# Altium schematic sheet Controller.SchDoc
size A2
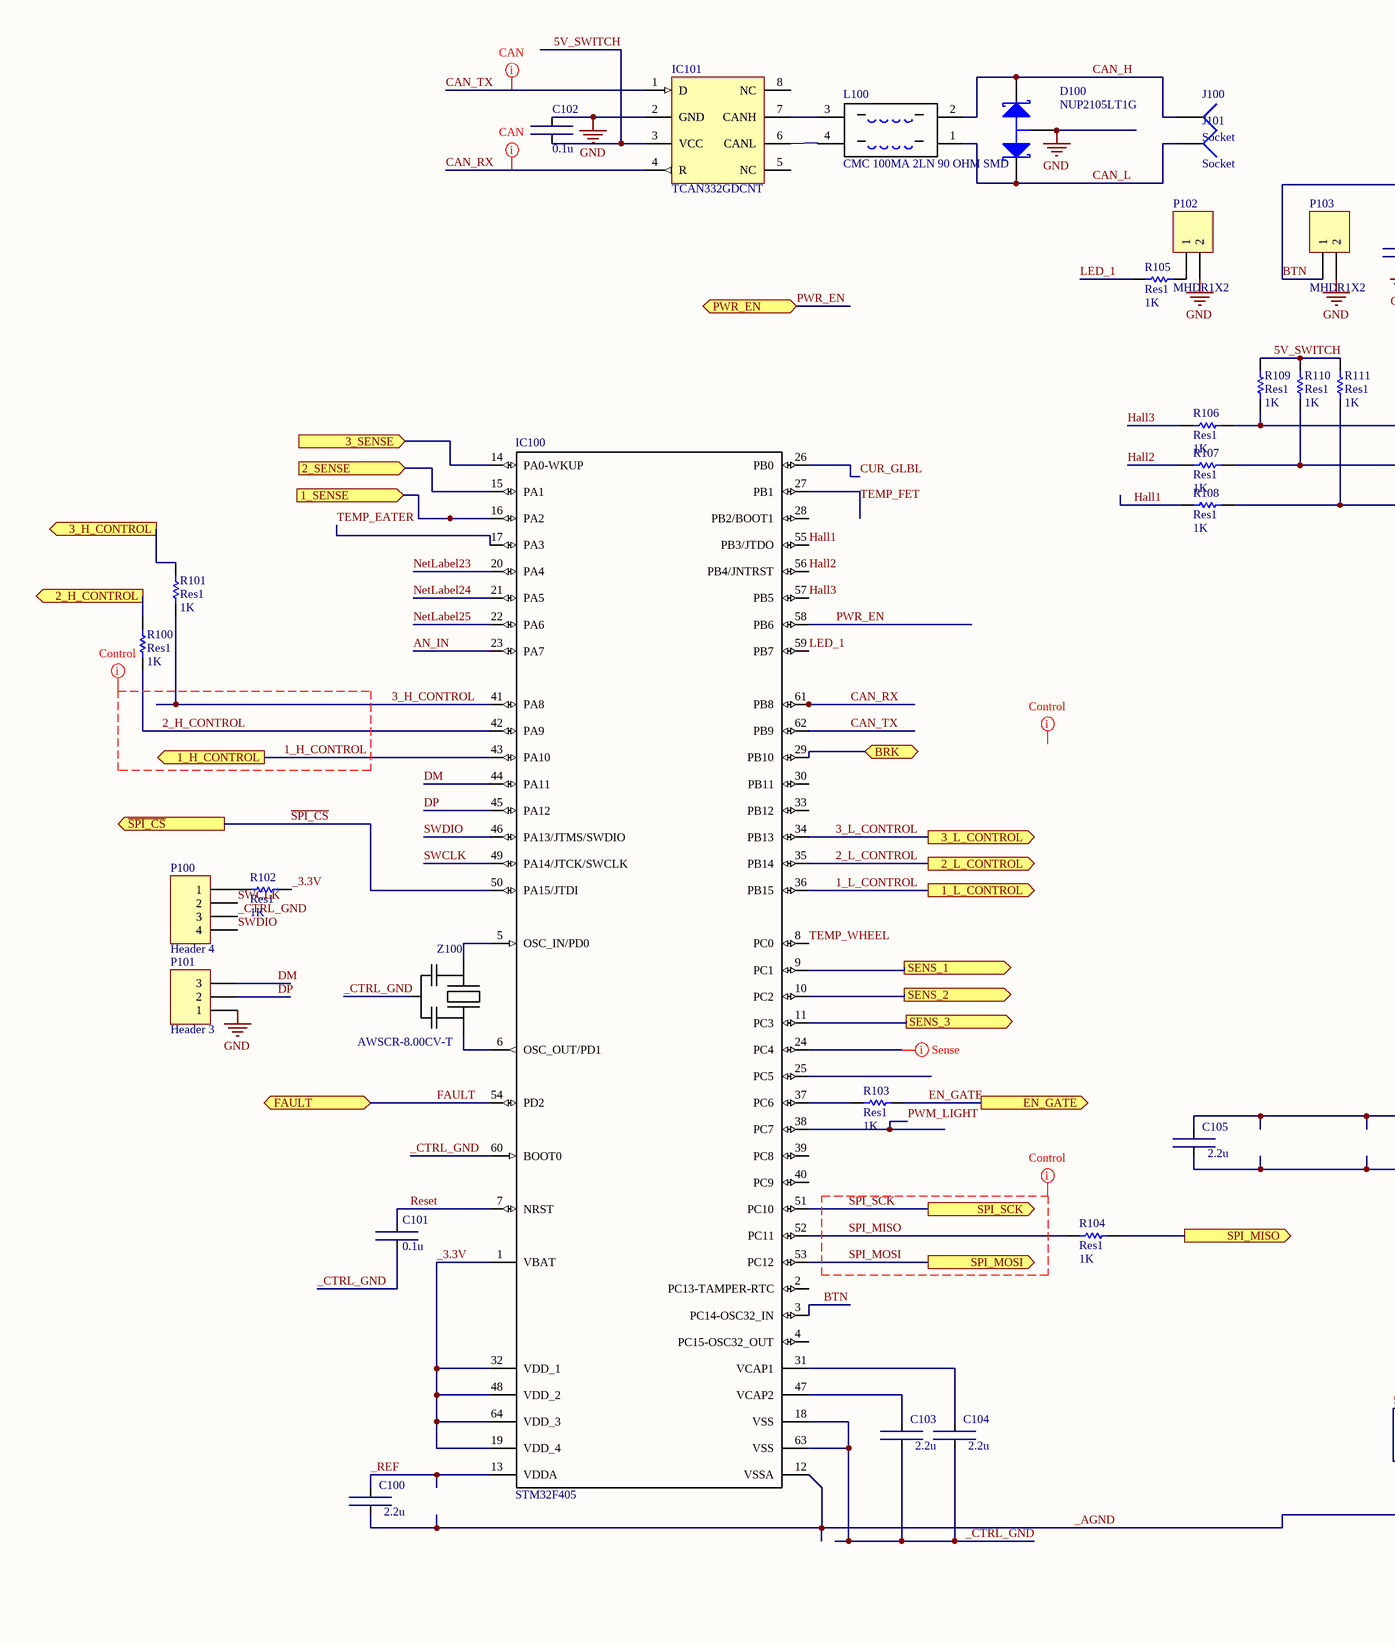
[diagram p0: Controller.SchDoc, left]
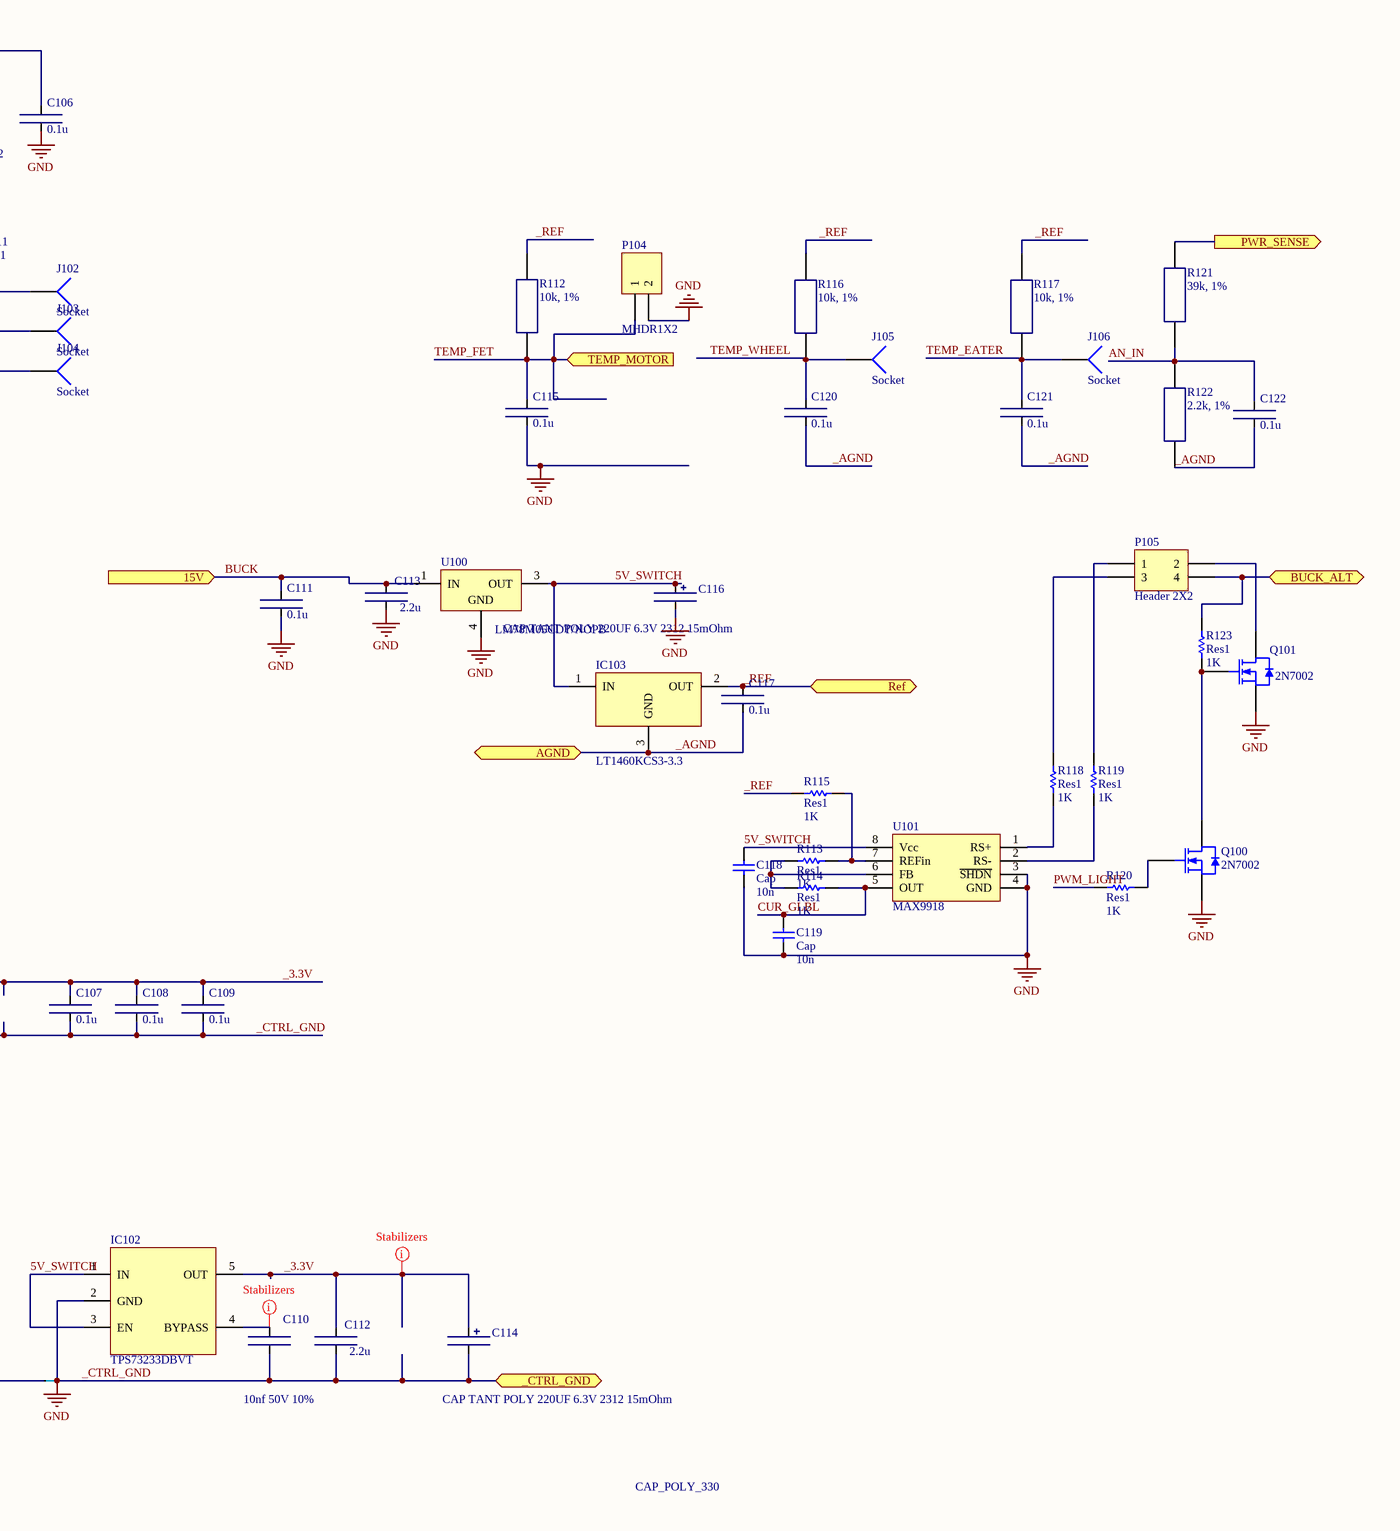
[diagram p1: Controller.SchDoc, right]

## Parts
C100  2.2u  [0603x]
C101  0.1u  [CAPC1608X08N(0603)]
C102  0.1u  [0603x]
C103  2.2u  [CAPC1608X08N(0603)]
C104  2.2u  [0603x]
C105  2.2u  [CAPC1608X08N(0603)]
C106  0.1u  [0603x]
C107  0.1u  [0603x]
C108  0.1u  [CAPC1608X08N(0603)]
C109  0.1u  [CAPC1608X08N(0603)]
C110  10nf 50V 10%  [0603x]
C111  0.1u  [ERA-0603]
C112  2.2u  [0603x]
C113  2.2u  [0603x]
C114  CAP TANT POLY 220UF 6.3V 2312 15mOhm  [CAP_POLY_330]
C115  0.1u  [0603x]
C116  CAP TANT POLY 220UF 6.3V 2312 15mOhm  [CAP_POLY_330]
C117  0.1u  [0603x]
C118  Cap  value 10n  [0603x]
C119  Cap  value 10n  [0603x]
C120  0.1u  [0603x]
C121  0.1u  [0603x]
C122  0.1u  [0603x]
D100  NUP2105LT1G  [SOT23_N]
IC100  STM32F405  [LQFP64_L]
IC101  TCAN332GDCNT  [SOT23-8_L]
IC102  TPS73233DBVT  [SOT23-5_L]
IC103  LT1460KCS3-3.3  [SOT-23]
J100  Socket  [PIN1]
J101  Socket  [PIN1]
J102  Socket  [PIN1]
J103  Socket  [PIN1]
J104  Socket  [PIN1]
J105  Socket  [PIN1]
J106  Socket  [PIN1]
L100  CMC 100MA 2LN 90 OHM SMD  [Choke_smd]
NT100  NET_TIE  [NET_TIE_20mil]  (value not drawn)  (net tie, no BOM)
P100  Header 4  [MHDR1X4]
P101  Header 3  [HDR1X3]
P102  MHDR1X2  [MHDR1X2]
P103  MHDR1X2  [MHDR1X2]
P104  MHDR1X2  [MHDR1X2]
P105  Header 2X2  [HDR2X2]
Q100  2N7002  [SOT-23]
Q101  2N7002  [SOT-23]
R100  Res1  value 1K  [0603x]
R101  Res1  value 1K  [0805x]
R102  Res1  value 1K  [0603x]
R103  Res1  value 1K  [1206x]
R104  Res1  value 1K  [0603x]
R105  Res1  value 1K  [0603x]
R106  Res1  value 1K  [0603x]
R107  Res1  value 1K  [0603x]
R108  Res1  value 1K  [0603x]
R109  Res1  value 1K  [0603x]
R110  Res1  value 1K  [0603x]
R111  Res1  value 1K  [0603x]
R112  10k, 1%  [1206x]
R113  Res1  value 1K  [0603x]
R114  Res1  value 1K  [0603x]
R115  Res1  value 1K  [0603x]
R116  10k, 1%  [0603x]
R117  10k, 1%  [0603x]
R118  Res1  value 1K  [0603x]
R119  Res1  value 1K  [0603x]
R120  Res1  value 1K  [0603x]
R121  39k, 1%  [1206x]
R122  2.2k, 1%  [0603x]
R123  Res1  value 1K  [0603x]
U100  LM78M05CDT/NOPB  [TD03B_N]
U101  MAX9918  [SO8_M]
Z100  AWSCR-8.00CV-T  [CRYSTAL_CERAMIC]

## Ports
1_H_CONTROL (out), 1_L_CONTROL (out), 1_SENSE (in), 2_H_CONTROL (out), 2_L_CONTROL (out), 2_SENSE (in), 3_H_CONTROL (out), 3_L_CONTROL (out), 3_SENSE (in), 15V (in), _CTRL_GND, AGND, BRK, BUCK_ALT, EN_GATE (out), FAULT, PWR_EN, PWR_SENSE (out), Ref, SENS_1 (out), SENS_2 (out), SENS_3 (out), SPI_MISO (out), SPI_MOSI (out), SPI_SCK (out), TEMP_MOTOR (in), ~{SPI_CS} (out)

## Nets
_CTRL_GND: C101.2 C102.1 C103.2 C104.2 C105.2 C106.2 C107.2 C108.2 C109.2 C110.2 C111.2 C112.2 C113.2 C114.2 C115.2 C116.2 C118.2 C119.2 D100.3(A) IC100.18(VSS) IC100.60(BOOT0) IC100.63(VSS) IC101.2(GND) IC102.2(GND) NT100.2 P100.3 P101.1 P102.2 P103.2 P104.2 Q100.2(S) Q101.2(S) U100.4(GND) U101.3(~{SHDN}) U101.4(GND) Z100.2(GND) ; port _CTRL_GND  [also labelled GND]
1_H_CONTROL: IC100.43(PA10) ; port 1_H_CONTROL
1_L_CONTROL: IC100.36(PB15) ; port 1_L_CONTROL
1_SENSE: IC100.16(PA2) ; port 1_SENSE
2_H_CONTROL: IC100.42(PA9) R100.2
2_H_CONTROL: R100.1 ; port 2_H_CONTROL  [a separate net that carries the same name]
2_L_CONTROL: IC100.35(PB14) ; port 2_L_CONTROL
2_SENSE: IC100.15(PA1) ; port 2_SENSE
3_H_CONTROL: IC100.41(PA8) R101.2
3_H_CONTROL: R101.1 ; port 3_H_CONTROL  [a separate net that carries the same name]
3_L_CONTROL: IC100.34(PB13) ; port 3_L_CONTROL
3_SENSE: IC100.14(PA0-WKUP) ; port 3_SENSE
5V_SWITCH: C102.2 C116.1 C118.1 IC101.3(VCC) IC102.1(IN) IC102.3(EN) IC103.1(IN) R109.2 R110.2 R111.2 U100.3(OUT) U101.8(Vcc)
_3.3V: C105.1 C107.1 C108.1 C109.1 C112.1 C114.1 IC100.1(VBAT) IC100.19(VDD_4) IC100.32(VDD_1) IC100.48(VDD_2) IC100.64(VDD_3) IC102.5(OUT) R102.2
_AGND: C100.2 C117.2 C120.2 C121.2 C122.2 IC100.12(VSSA) IC103.3(GND) NT100.1 R122.2 ; port AGND
_REF: C100.1 C117.1 IC100.13(VDDA) IC103.2(OUT) R112.1 R115.2 R116.1 R117.1 ; port Ref
AN_IN: C122.1 IC100.23(PA7) R121.2 R122.1
BRK: IC100.29(PB10) ; port BRK
BTN: C106.1 IC100.3(PC14-OSC32_IN) P103.1
BUCK: C111.1 C113.1 U100.1(IN) ; port 15V
BUCK_ALT: P105.4 R123.1 ; port BUCK_ALT
CAN_H: D100.1(K1) J100.1 L100.2
CAN_L: D100.2(K2) J101.1 L100.1
CAN_RX: IC100.61(PB8) IC101.4(R)
CAN_TX: IC100.62(PB9) IC101.1(D)
CUR_GLBL: C119.1 IC100.26(PB0) R114.1 U101.5(OUT)
DM: IC100.44(PA11) P101.3
DP: IC100.45(PA12) P101.2
EN_GATE: R103.1 ; port EN_GATE
FAULT: IC100.54(PD2) ; port FAULT
Hall1: IC100.55(PB3/JTDO) R108.1
Hall2: IC100.56(PB4/JNTRST) R107.1
Hall3: IC100.57(PB5) R106.1
LED_1: IC100.59(PB7) R105.1
NetLabel23: IC100.20(PA4)
NetLabel24: IC100.21(PA5)
NetLabel25: IC100.22(PA6)
PWM_LIGHT: IC100.38(PC7) R120.1
PWR_EN: IC100.58(PB6) ; port PWR_EN
PWR_SENSE: R121.1 ; port PWR_SENSE
Reset: C101.1 IC100.7(NRST)
~{SPI_CS}: IC100.50(PA15/JTDI) ; port ~{SPI_CS}
SENS_1: IC100.9(PC1) ; port SENS_1
SENS_2: IC100.10(PC2) ; port SENS_2
SENS_3: IC100.11(PC3) ; port SENS_3
SPI_MISO: IC100.52(PC11) R104.2
SPI_MISO: R104.1 ; port SPI_MISO  [a separate net that carries the same name]
SPI_MOSI: IC100.53(PC12) ; port SPI_MOSI
SPI_SCK: IC100.51(PC10) ; port SPI_SCK
SWCLK: IC100.49(PA14/JTCK/SWCLK) P100.2
SWDIO: IC100.46(PA13/JTMS/SWDIO) P100.4
TEMP_EATER: C121.1 IC100.17(PA3) J106.1 R117.2
TEMP_FET: C115.1 IC100.27(PB1) P104.1 R112.2 ; port TEMP_MOTOR
TEMP_WHEEL: C120.1 IC100.8(PC0) J105.1 R116.2
NetC103_1: C103.1 IC100.47(VCAP2)
NetC104_1: C104.1 IC100.31(VCAP1)
NetC110_1: C110.1 IC102.4(BYPASS)
NetIC100_5: IC100.5(OSC_IN/PD0) Z100.1(X1)
NetIC100_6: IC100.6(OSC_OUT/PD1) Z100.3(X2)
NetIC100_37: IC100.37(PC6) R103.2
NetIC101_6: IC101.6(CANL) L100.4
NetIC101_7: IC101.7(CANH) L100.3
NetJ102_1: J102.1 R106.2 R109.1
NetJ103_1: J103.1 R107.2 R110.1
NetJ104_1: J104.1 R108.2 R111.1
NetP100_1: P100.1 R102.1
NetP102_1: P102.1 R105.2
NetP105_1: P105.1 R119.1
NetP105_2: P105.2 Q101.3(D)
NetP105_3: P105.3 R118.1
NetQ100_1: Q100.1(G) R120.2
NetQ100_3: Q100.3(D) Q101.1(G) R123.2
NetR113_1: R113.1 R115.1 U101.7(REFin)
NetR113_2: R113.2 R114.2 U101.6(FB)
NetR118_2: R118.2 U101.1(RS+)
NetR119_2: R119.2 U101.2(RS-)

Not connected (* = marked no-connect by the designer): IC100 2(PC13-TAMPER-RTC) 4(PC15-OSC32_OUT) 24(PC4) 25(PC5) 28(PB2/BOOT1) 30(PB11) 33(PB12) 39(PC8) 40(PC9); IC101 5(NC) 8(NC)

## Layout directives
net class Stabilizers: _3.3V, NetC110_1
net class Control: 1_H_CONTROL, 2_H_CONTROL, (no net found under the mark), SPI_MISO, SPI_MOSI, SPI_SCK
net class Sense: NetIC100_24
net class CAN: CAN_RX, CAN_TX

## Notes on the sheet
- CAP_POLY_330
- Title
- Size:
- Date:
- File:
- A2
- Number:
- Time:
- Revision:
- Sheet
- of

## Library data of the parts
C100 C103-C105 C112 C113 = Ceramic Chip Capacitor: Value: CAP CER 2.2UF 25V X5R 0603; Order Number: GRM188R61E225KA12D; Distributor: Murata Electronics; Package: CAPC1608X08N(0603)
C101 C102 C106-C109 C111 C115 C117 C120-C122 = Ceramic Chip Capacitor: Value: CAP CER 0.1UF 50V X7R 0603; Order Number: 06035C104KAT2A; Distributor: AVX Corporation
  C101 C102 C106 C111 C115 C117 C120-C122: Package: 0603
  C107-C109: Package: CAPC1608X08N(0603)
C110 = Ceramic Chip Capacitor: Value: CAP CER 10000PF 50V X7R 0402; Order Number: CGA2B3X7R1H103K050BD; Distributor: TDK Corporation; Package: 0402
C114 C116 = Tantalum Chip Capacitor: Order Number: T520C227M006ATE015; Value: CAP TANT POLY 220UF 6.3V 2312 15mOhm; Package: C; Distributor: KEMET
C118 C119 = Cap: Capacitor; Published: 8-Jun-2000; LatestRevisionDate: 17-Jul-2002; LatestRevisionNote: Re-released for DXP Platform.; PackageReference: RAD-0.3; Publisher: Altium Limited; PackageDescription: Radial Cap, Thru-Hole; 2 Leads; 0.3 in Pin Spacing
D100 = BAT54A: Schottky Barrier Double Diode; LatestRevisionNote: IPC-7351 Footprint Added.; Package: SOT23; PackageDescription: 3-Pin SOT-23 Package 0.95 mm Pitch, 2.3 mm Lead Span; ComponentLink1Description: Manufacturer Link; ComponentLink1URL: http://www.semiconductors.philips.com/; Value: NUP2105LT1G; Distributor: ON Semiconductor; Order Number: NUP2105LT1G
IC100 = STM32F405: STM32 ARM-based 32-bit MCU; Order Number: STM32F405RGT6; Value: STM32F405RGT6; Package: LQFP-64; Distributor: STMicroelectronics
IC102 = TPS7xx33: Value: LDO 3.3V 250mA; Order Number: TPS73233DBVT; Distributor: Texas Instruments; Package: SOT23-5
IC103 = PreciseRef: Value: Voltage reference 3.3V 0.5% 50ppm/C; Order Number: LT1460KCS3-3.3#TRMPBF; Distrubutor: Linear Technology; Package: SOT23
L100 = Choke: Order Number: EXC-34CG900U; Distributor: Panasonic; Value: CMC 100MA 2LN 90 OHM SMD; Package: 0805 (2012 Metric), 4 PC Pad
NT100 = Net tie
P100 = Header 4: Header, 4-Pin; LatestRevisionDate: 17-Jul-2002; LatestRevisionNote: Re-released for DXP Platform.; Publisher: Altium Limited
P101 = Header 3: Header, 3-Pin; LatestRevisionDate: 17-Jul-2002; LatestRevisionNote: Re-released for DXP Platform.; Publisher: Altium Limited
P102-P104 = MHDR1X2: Header, 2-Pin; LatestRevisionDate: 17-Jul-2002; LatestRevisionNote: Re-released for DXP Platform.; Publisher: Altium Limited
P105 = Header 2X2: Header, 2-Pin, Dual row; LatestRevisionDate: 17-Jul-2002; LatestRevisionNote: Re-released for DXP Platform.; Publisher: Altium Limited
Q100 Q101 = 2N7002: N-channel Enhancement Mode Field-effect Transistor; Published: 17-Sep-2003; LatestRevisionDate: 12-Dec-2006; LatestRevisionNote: IPC-7351 Footprint Added.; DatasheetVersion: 27-Jul-2000; PackageVersion: May-1999; PackageReference: SOT23; Publisher: Altium Limited; PackageDescription: 3-Pin SOT-23 Package 0.95 mm Pitch, 2.3 mm Lead Span; ComponentLink1Description: Manufacturer Link; ComponentLink1URL: http://www.semiconductors.philips.com/; ComponentLink2Description: Datasheet; ComponentLink2URL: http://www.semiconductors.philips.com/acrobat/datasheets/2N7002_4.pdf
R100-R111 R113-R115 R118-R120 R123 = Res1: Resistor; Published: 8-Jun-2000; LatestRevisionDate: 17-Jul-2002; LatestRevisionNote: Re-released for DXP Platform.; PackageReference: AXIAL-0.3; Publisher: Altium Limited; PackageDescription: Axial Device, Thru-Hole; 2 Leads; 0.3 in Pin Spacing
R112 R116 R117 = SMD: Value: RES SMD 10K OHM 1% 1/10W 0603; Order Number: ERJ-3EKF1002V; Package: RESC1608X05N(0603); Distributor: Panasonic
R121 = SMD: Value: RES SMD 39K OHM 1% 1/10W 0603; Order Number: ERJ-3EKF3902V; Package: RESC1608X05N(0603); Distributor: Panasonic
R122 = SMD: Value: RES SMD 2.2K OHM 1% 1/10W 0603; Order Number: ERJ-3EKF2201V; Package: RESC1608X05N(0603); Distributor: Panasonic
U100 = LM78M05CDT/NOPB: 3-Terminal Positive Voltage Regulators, 3-pin TO-252, Pb-Free; Manufacturer: National Semiconductor; PackageTopMarking: NSUZXYTT*LM78M05*CDT; PowerWise: N; CompType: LDO IC; Published: 1-Mar-2010; DatasheetVersion: Aug-2005; PackageVersion: revD, Feb-2009; PackageReference: TD03B; Publisher: Altium Limited; PackageDescription: TO252, Molded, Jedec, 6.8 x 6.10 x 2.30mm Body, 3 Lead, 2.28mm Pitch, Surface Mount; Supplier 1: Digi-Key; Supplier Part Number 1: LM78M05CDT-ND; Supplier 2: Farnell; Supplier Part Number 2: 1469112; PartNumber: LM78M05CDT/NOPB; RoHS: Y; PinCount: 3; Code_JEDEC: TO-252-AA; ComponentLink1Description: LM78M05 Datasheet; ComponentLink1URL: http://www.national.com/ds/LM/LM78M05.pdf; ComponentLink2Description: LM78M05 Web Page; ComponentLink2URL: http://www.national.com/pf/LM/LM78M05.html; ComponentLink3Description: TD03B Package Page; ComponentLink3URL: http://www.national.com/packaging/folders/td03b.html
Z100 = Crystal_smd_with_caps: Value: CER RES 8.0000MHZ 22PF SMD; Order Number: AWSCR-8.00CV-T; Distributor: Abracon LLC; Package: 3-SMD, Non-Standard
IC101 = TCAN332GDCNT: Order Number: TCAN332GDCNT; Package: SOT23-8; Value: TCAN332GDCNT; Distributor: Texas Instruments
J100-J106 = Socket: LatestRevisionDate: 17-Jul-2002; LatestRevisionNote: Re-released for DXP Platform.; Publisher: Altium Limited